# EAGLE design kontrol_v2 (EAGLE 9.6.1)
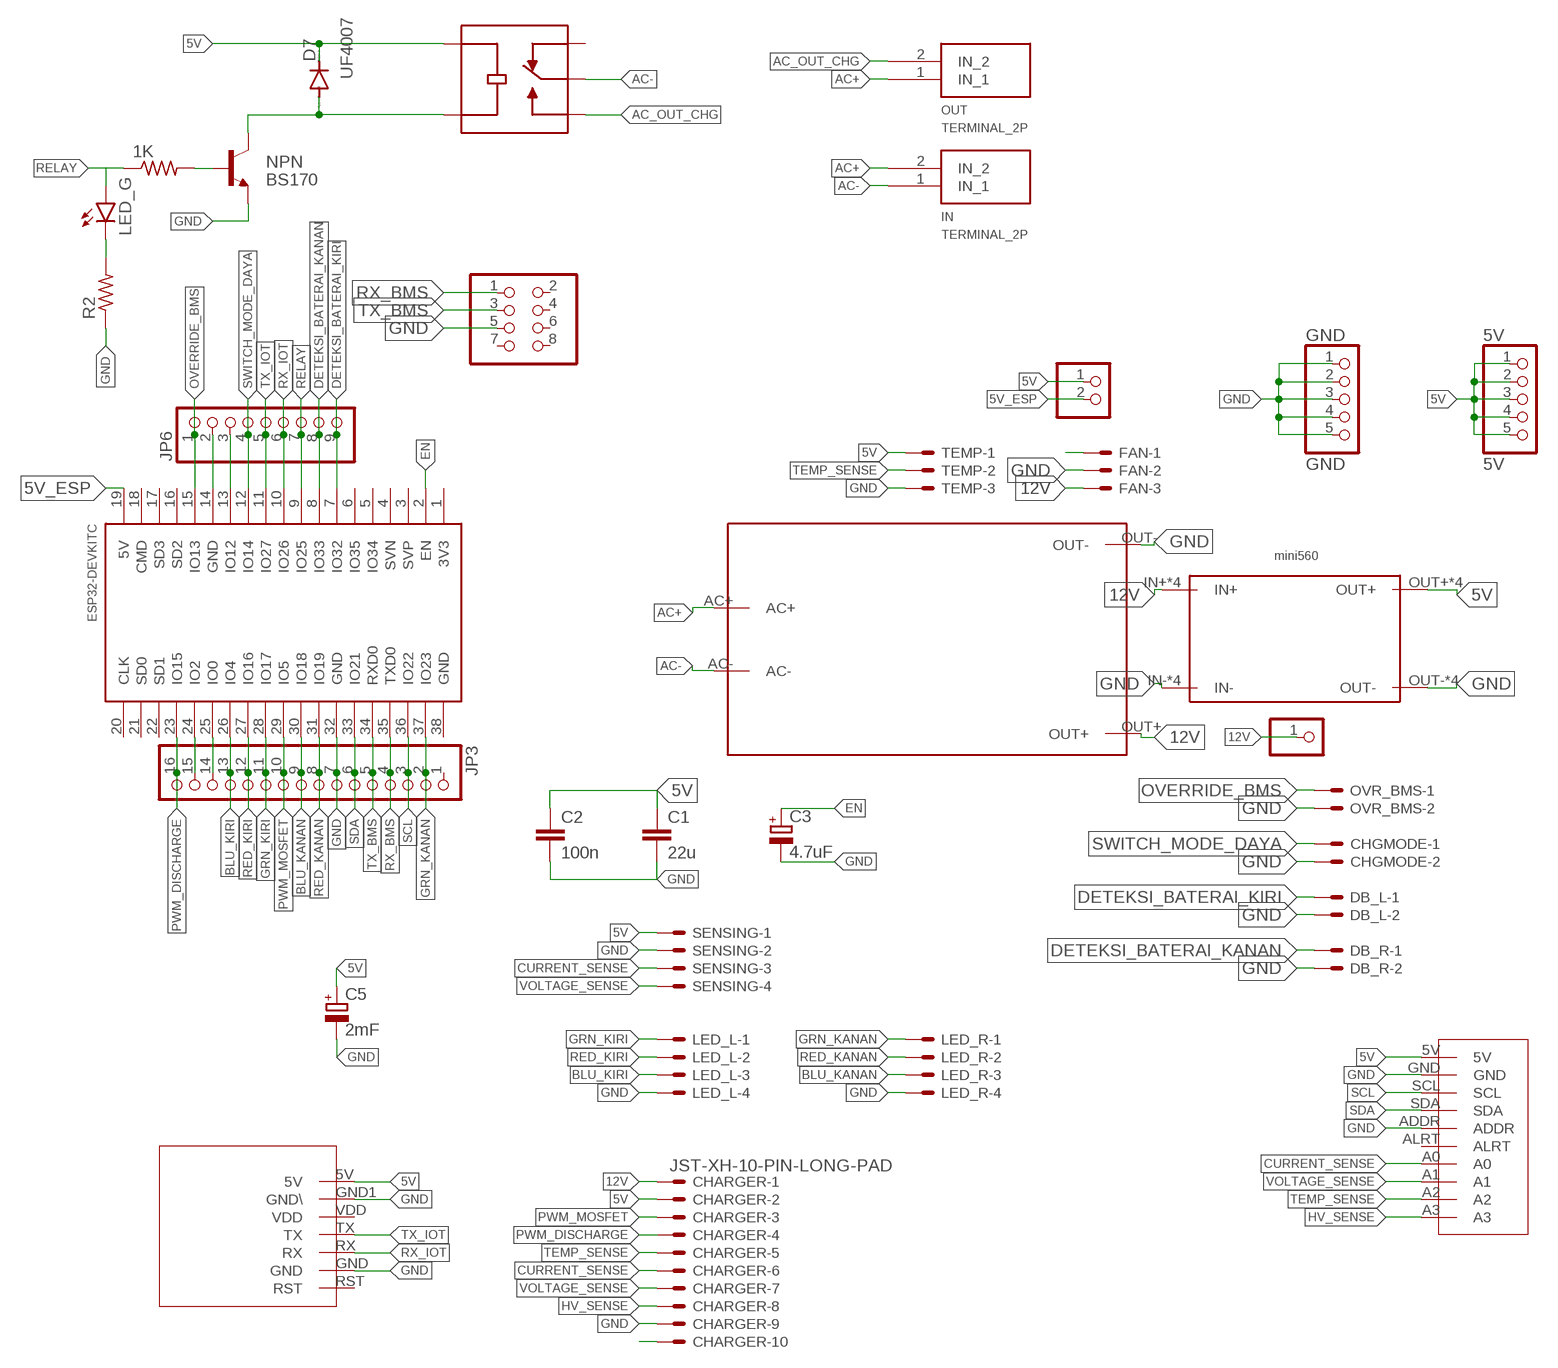
[diagram p0: schematic, sheet 1]

## Parts
1K  1k  R-US_0204/7  [0204/7]
5V  5V  PINHD-1X5  [1X05]
C1  22u  C2.5/5  [C2.5-5]
C2  100n  C2.5/6  [C2.5-6]
C3  4.7uF  CPOL-EUE2,5-6E  [E2,5-6E]
C5  2mF  CPOL-EUE3.5-10  [E3,5-10]
CHARGER  JST-XH-10-PIN-LONG-PAD  [JST-XH-10-PACKAGE-LONG-PAD]
CHGMODE  JST-XH-02-PIN-LONG-PAD  [JST-XH-02-PACKAGE-LONG-PAD]
D4  LED_G  LED5MM  [LED_5MM]
D7  UF4007  BAS15  [DO34-7]
DB_L  JST-XH-02-PIN-LONG-PAD  [JST-XH-02-PACKAGE-LONG-PAD]
DB_R  JST-XH-02-PIN-LONG-PAD  [JST-XH-02-PACKAGE-LONG-PAD]
FAN  JST-XH-03-PIN-LONG-PAD  [JST-XH-03-PACKAGE-LONG-PAD]
GND  GND  PINHD-1X5  [1X05]
HI_LINK1  HI_LINK  [HI_LINK]
IN  TERMINAL_2P  [TERMINAL_2P]
JP2  PINHD-2X4  [2X04]
JP3  PINHD-1X16  [1X16]
JP4  PINHD-1X1  [1X01]
JP6  PINHD-1X9  [1X09]
JP7  PINHD-1X2  [1X02]
K1  SRD-12VDC-SL-C  [RELAY_SRD-12VDC-SL-C]
LED_L  JST-XH-04-PIN-LONG-PAD  [JST-XH-04-PACKAGE-LONG-PAD]
LED_R  JST-XH-04-PIN-LONG-PAD  [JST-XH-04-PACKAGE-LONG-PAD]
MINI1  MINI560  [MINI560]
NPN  BS170  BC547A-NPN-TO92-CBE  [TO92-CBE]
OUT  TERMINAL_2P  [TERMINAL_2P]
OVR_BMS  JST-XH-02-PIN-LONG-PAD  [JST-XH-02-PACKAGE-LONG-PAD]
R2  6k  R-US_0204/7  [0204/7]
SENSING  JST-XH-04-PIN-LONG-PAD  [JST-XH-04-PACKAGE-LONG-PAD]
TEMP  JST-XH-03-PIN-LONG-PAD  [JST-XH-03-PACKAGE-LONG-PAD]
U$1  ESP32DEVKITC  [ESP32-DEVKITC]
U$2  ADS1115  [ADS1115]
U$3  SIM800V2  [SIM800V2]

## Nets
5V: 5V.1 5V.2 5V.3 5V.4 5V.5 C1.1 C2.1 C5.+ CHARGER.2 D7.C JP7.1 K1.COIL1 MINI1.OUT+ MINI1.OUT+1(OUT+) MINI1.OUT+2(OUT+) MINI1.OUT+3(OUT+) SENSING.1 TEMP.1 U$2.5V U$3.5V
5V_ESP: JP7.2 U$1.19(5V)
12V: CHARGER.1 FAN.3 HI_LINK1.OUT+ JP4.1 MINI1.IN+ MINI1.IN+1(IN+) MINI1.IN+2(IN+) MINI1.IN+3(IN+)
AC+: HI_LINK1.AC+ IN.2(IN_2) OUT.1(IN_1)
AC-: HI_LINK1.AC- IN.1(IN_1) K1.COM
AC_OUT_CHG: K1.NO OUT.2(IN_2)
BLU_KANAN: JP3.9 LED_R.3 U$1.30(IO18)
BLU_KIRI: JP3.13 LED_L.3 U$1.26(IO4)
CURRENT_SENSE: CHARGER.6 SENSING.3 U$2.A0
DETEKSI_BATERAI_KANAN: DB_R.1 JP6.8 U$1.8(IO33)
DETEKSI_BATERAI_KIRI: DB_L.1 JP6.9 U$1.7(IO32)
EN: C3.+ U$1.2(EN)
GND: C1.2 C2.2 C3.- C5.- CHARGER.9 CHGMODE.2 DB_L.2 DB_R.2 FAN.2 GND.1 GND.2 GND.3 GND.4 GND.5 HI_LINK1.OUT- JP2.5 JP3.7 LED_L.4 LED_R.4 MINI1.IN- MINI1.IN-1(IN-) MINI1.IN-2(IN-) MINI1.IN-3(IN-) MINI1.OUT- MINI1.OUT-1(OUT-) MINI1.OUT-2(OUT-) MINI1.OUT-3(OUT-) NPN.E OVR_BMS.2 R2.1 SENSING.2 TEMP.3 U$1.32(GND) U$2.ADDR U$2.GND U$3.GND U$3.GND1(GND\)
GRN_KANAN: JP3.2 LED_R.1 U$1.37(IO23)
GRN_KIRI: JP3.11 LED_L.1 U$1.28(IO17)
HV_SENSE: CHARGER.8 U$2.A3
N$1: D4.K(C) R2.2
N$2: FAN.1
N$8: JP6.2 U$1.14(GND)
N$9: JP6.3 U$1.13(IO12)
N$14: CHARGER.10
N$19: 1K.2 NPN.B
N$21: D7.A K1.COIL2 NPN.C
N$23: JP3.14 U$1.25(IO0)
N$24: JP3.15 U$1.24(IO2)
OVERRIDE_BMS: JP6.1 OVR_BMS.1 U$1.15(IO13)
PWM_DISCHARGE: CHARGER.4 JP3.16 U$1.23(IO15)
PWM_MOSFET: CHARGER.3 JP3.10 U$1.29(IO5)
RED_KANAN: JP3.8 LED_R.2 U$1.31(IO19)
RED_KIRI: JP3.12 LED_L.2 U$1.27(IO16)
RELAY: 1K.1 D4.A JP6.7 U$1.9(IO25)
RX_BMS: JP2.1 JP3.4 U$1.35(TXD0)
RX_IOT: JP6.6 U$1.10(IO26) U$3.RX
SCL: JP3.3 U$1.36(IO22) U$2.SCL
SDA: JP3.6 U$1.33(IO21) U$2.SDA
SWITCH_MODE_DAYA: CHGMODE.1 JP6.4 U$1.12(IO14)
TEMP_SENSE: CHARGER.5 TEMP.2 U$2.A2
TX_BMS: JP2.3 JP3.5 U$1.34(RXD0)
TX_IOT: JP6.5 U$1.11(IO27) U$3.TX
VOLTAGE_SENSE: CHARGER.7 SENSING.4 U$2.A1
Unconnected: JP2.2 JP2.4 JP2.6 JP2.7 JP2.8 JP3.1 K1.NC U$1.1(3V3) U$1.3(SVP) U$1.4(SVN) U$1.5(IO34) U$1.6(IO35) U$1.16(SD2) U$1.17(SD3) U$1.18(CMD) U$1.20(CLK) U$1.21(SD0) U$1.22(SD1) U$1.38(GND) U$2.ALRT U$3.RST U$3.VDD

## Library data of the parts
1K R2 = rcl:R-US_: RESISTOR, American symbol; SPICEPREFIX: R
5V GND = pinhead:PINHD-1X5: PIN HEADER
C1 C2 = capacitor-wima:C: CAPACITOR naming: grid - package width
C3 C5 = rcl:CPOL-EU: POLARIZED CAPACITOR, European symbol; SPICEPREFIX: C
CHARGER = Rembrandt Electronics - JST XH Connectors v1-0:JST-XH-10-PIN: JST XH Connector 2 Pin Wire to board connector. Pitch: 2,54 mm, (0.100") Number of pins: 10 Created by Rembrandt Electronics www.rembrandtelectronics.com
CHGMODE DB_L DB_R OVR_BMS = JST XH Connectors v1-0:JST-XH-02-PIN: JST XH Connector 2 Pin Wire to board connector. Pitch: 2,54 mm, (0.100") Number of pins: 2 Created by Rembrandt Electronics www.rembrandtelectronics.com
D4 = Sparkfun_LED:LED: LED (Generic) Standard schematic elements and footprints for 5mm, 3mm, 1206, and 0603 sized LEDs. Generic LEDs with no color specified.
D7 = diode:BAS15: DIODE high speed
FAN TEMP = JST XH Connectors v1-0:JST-XH-03-PIN: JST XH Connector 2 Pin Wire to board connector. Pitch: 2,54 mm, (0.100") Number of pins: 3 Created by Rembrandt Electronics www.rembrandtelectronics.com
HI_LINK1 = Hi Link:HI_LINK
IN OUT = TA_library:TERMINAL_2P
JP2 = pinhead:PINHD-2X4: PIN HEADER
JP3 = pinhead:PINHD-1X16: PIN HEADER
JP4 = pinhead:PINHD-1X1: PIN HEADER
JP6 = pinhead:PINHD-1X9: PIN HEADER
JP7 = pinhead:PINHD-1X2: PIN HEADER
K1 = TA_library:SRD-12VDC-SL-C: General Purpose Non Latching 12VDC SPDT Through Hole Relays RoHS Check availability <https://pricing.snapeda.com/parts/SRD-12VDC-SL-C/Songle%20Relay/view-part?ref=eda>; AVAILABILITY: Not in stock; DESCRIPTION: General Purpose Non Latching 12VDC SPDT Through Hole Relays RoHS; MF: Songle Relay; MP: SRD-12VDC-SL-C; PACKAGE: Package; PRICE: None
LED_L LED_R SENSING = JST XH Connectors v1-0:JST-XH-04-PIN: JST XH Connector 2 Pin Wire to board connector. Pitch: 2,54 mm, (0.100") Number of pins: 4 Created by Rembrandt Electronics www.rembrandtelectronics.com
MINI1 = mini560:MINI560
NPN = transistor:*-NPN-: NPN Transistror BF959 corrected 2008.03.06
U$1 = ESP32-DEVKITC:ESP32DEVKITC
U$2 = ADS1115:ADS1115
U$3 = sim800v2:SIM800V2

## Net classes
1 3A: width 3.302 mm, clearance 0.61 mm
3 HIGH Voltage: width 2.032 mm, clearance 2.54 mm
4 AC: width 2.032 mm, clearance 2.54 mm

## Board
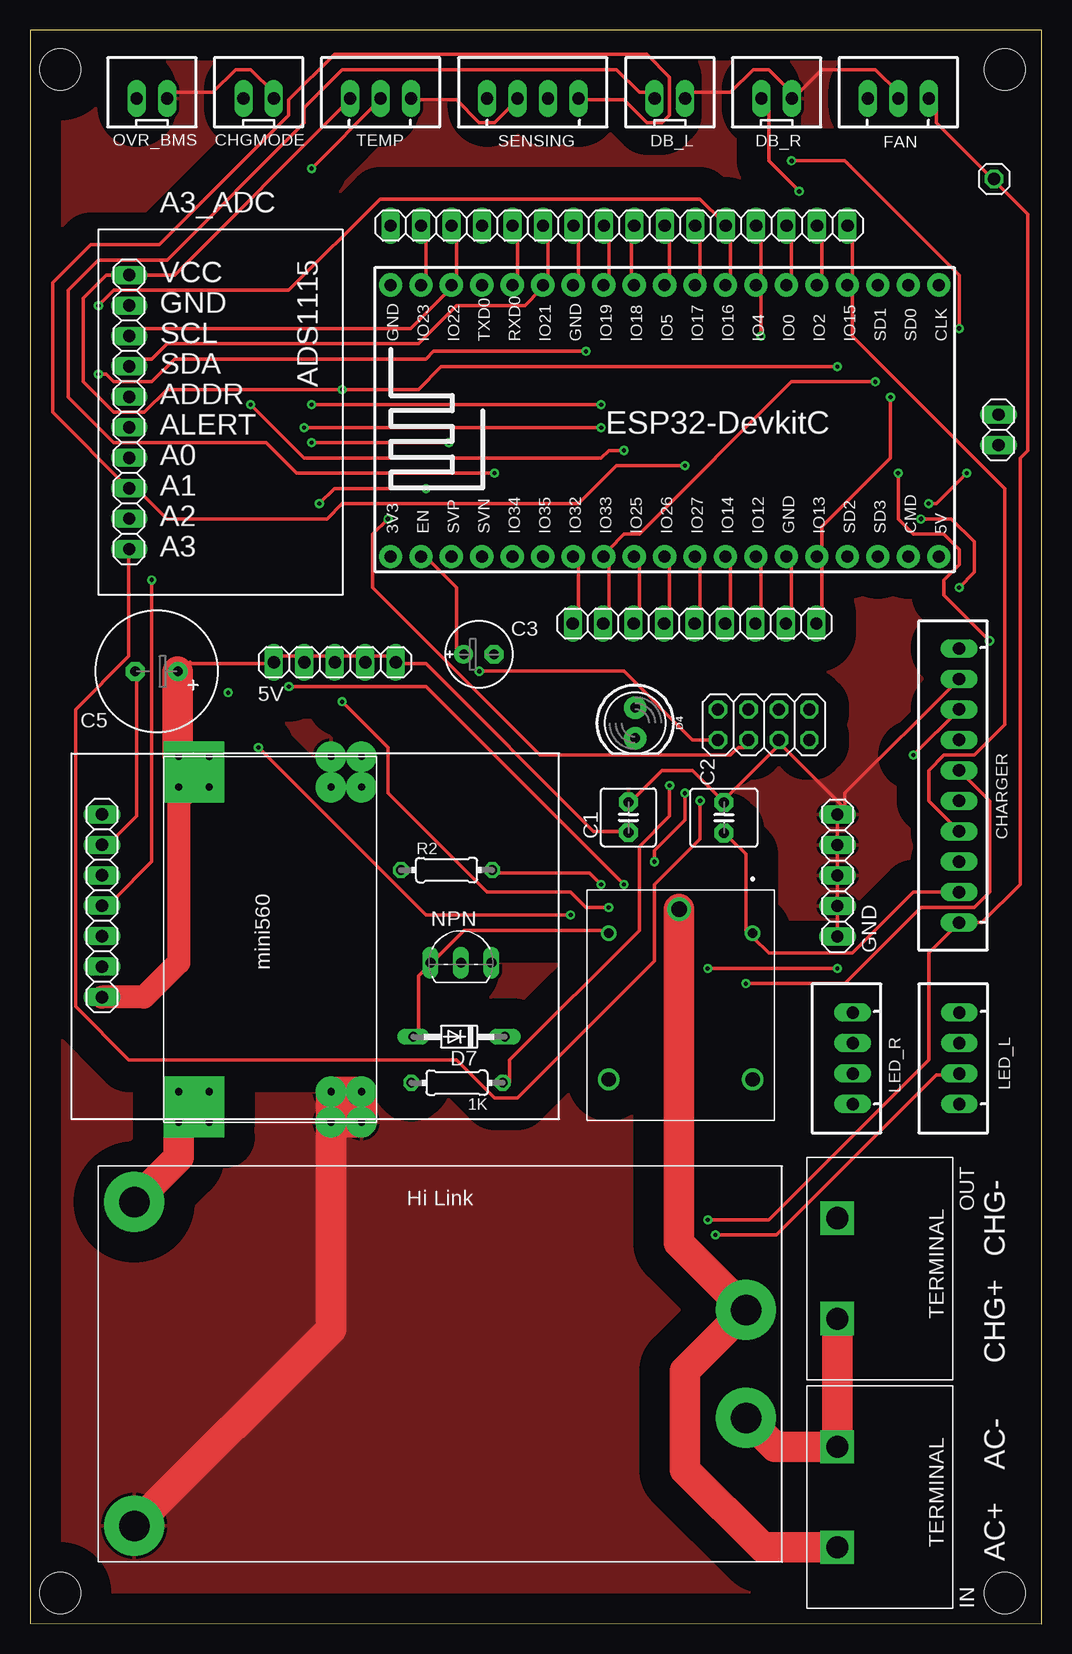
[diagram p1: board, top side]
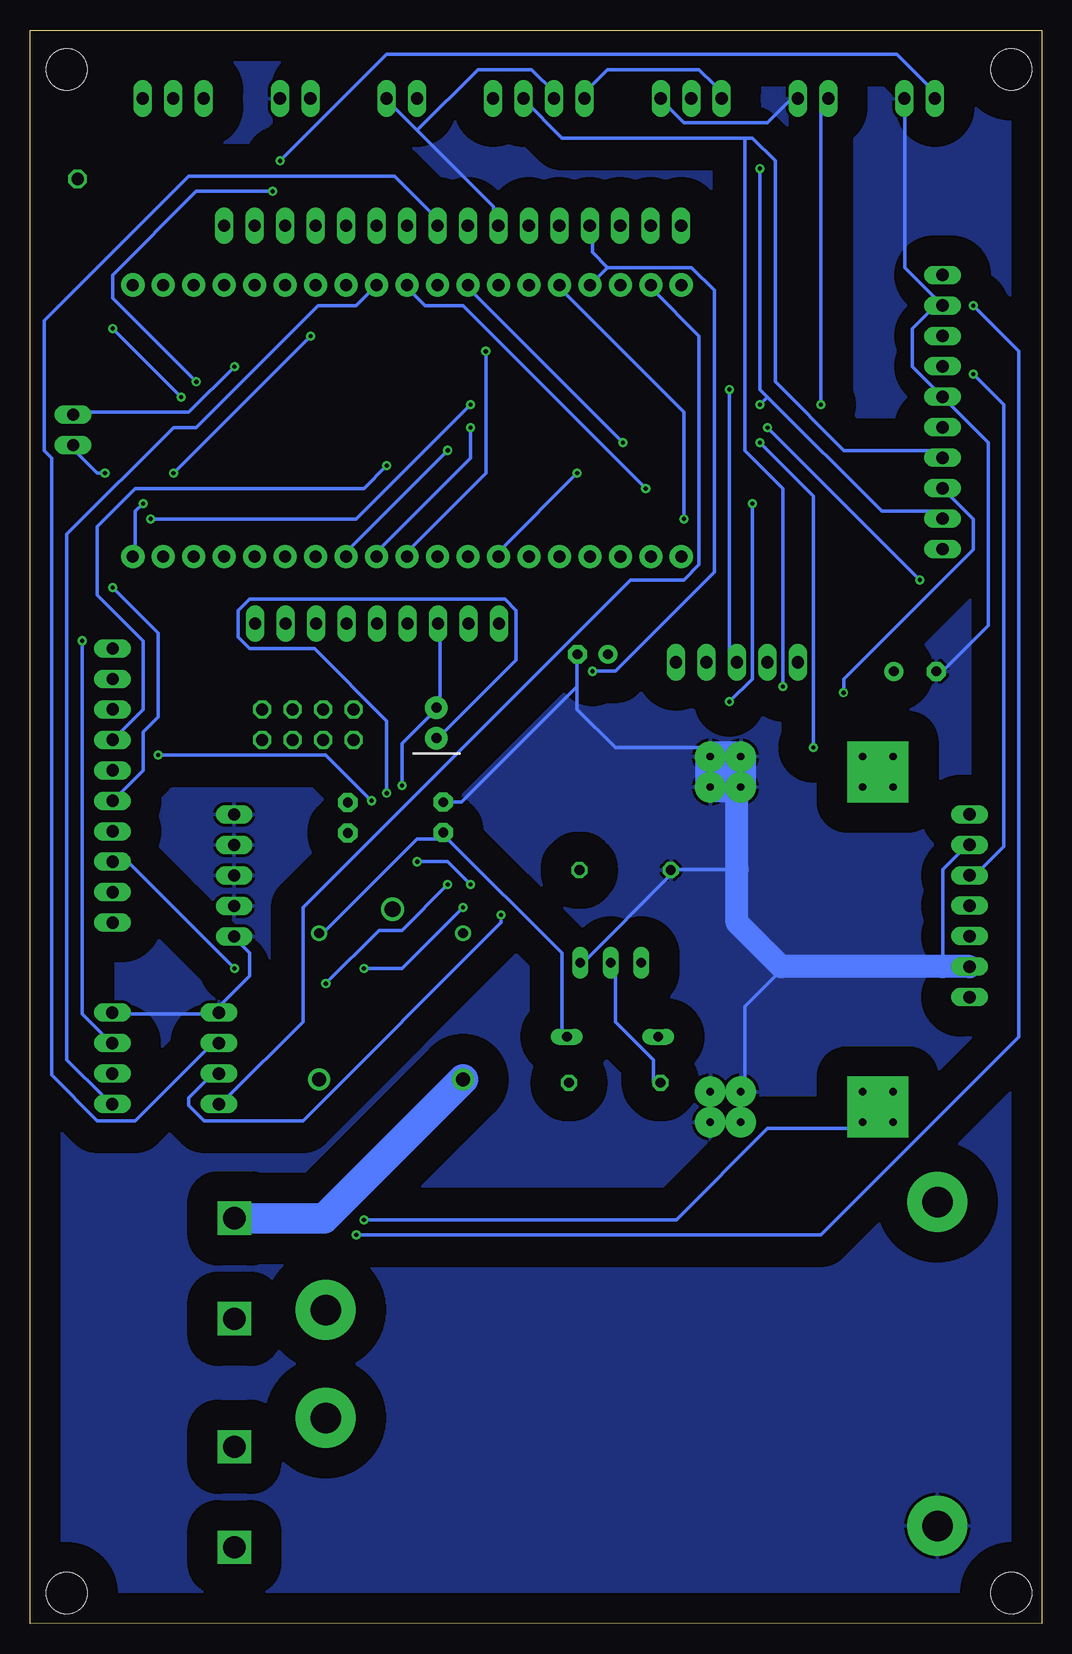
[diagram p2: board, bottom side, seen from below]

Size 84.35 x 132.84 mm. Coordinates in mm from the lower left corner, seen from the top.
Outline: 0,0.01 84.34,0 84.35,132.81 0.01,132.84 0,0.01
Copper layers (1*16): Top 0.035mm / dielectric 1.5mm / Bottom 0.035mm
Design rules "default *": minimum track width 12mil, minimum drill 0.35mm, track to track 24mil, track to pad 12mil, pad to pad 12mil, via to via 24mil, smd to smd 12mil, copper to edge 40mil, drill to drill 6mil, minimum pad ring 10mil, minimum via ring 8mil, stop-mask expansion 4mil, vias tented up to drill 0mil, thermal gap 10mil
Holes 3.4 mm at 81.27,2.55 2.53,129.55 81.27,129.55 2.53,2.55

### Footprints (pad centres in the part's own frame; a part is rotated, then mirrored left to right if it is on the bottom)
0204/7 = drill 0.813 octagon: 1 -3.81,0; 2 3.81,0
1X05 = drill 1.016 long: 1 -5.08,0; 2 -2.54,0; 3 0,0; 4 2.54,0; 5 5.08,0
C2.5-5 = drill 0.813 pad 1.6 octagon: 1 -1.27,0; 2 1.27,0
C2.5-6 = drill 0.813 pad 1.6 octagon: 1 -1.27,0; 2 1.27,0
E2,5-6E = drill 0.813 pad 1.575: + -1.27,0 | drill 0.813 pad 1.575 octagon: - 1.27,0
E3,5-10 = drill 0.813 pad 1.6: + -1.778,0 | drill 0.813 pad 1.6 octagon: - 1.778,0
JST-XH-10-PACKAGE-LONG-PAD = drill 1.016 long: 1 -11.43,0; 2 -8.89,0; 3 -6.35,0; 4 -3.81,0; 5 -1.27,0; 6 1.27,0; 7 3.81,0; 8 6.35,0; 9 8.89,0; 10 11.43,0
JST-XH-02-PACKAGE-LONG-PAD = drill 1.016 long: 1 -1.27,0; 2 1.27,0
LED_5MM = drill 0.813 pad 1.88: A -1.27,0; K 1.27,0
DO34-7 = drill 0.813 long: A 3.81,0; C -3.81,0
JST-XH-03-PACKAGE-LONG-PAD = drill 1.016 long: 1 -2.54,0; 2 0,0; 3 2.54,0
HI_LINK = drill 2.54 pad 5: AC+ -23.67,4.49; AC- -23.67,-4.51; OUT+ 27.33,-13.51; OUT- 27.33,13.49
TERMINAL_2P = drill 1.854 square: 1 0,-3.81; 2 0,4.572
2X04 = drill 1.016 octagon: 1 -3.81,-1.27; 2 -3.81,1.27; 3 -1.27,-1.27; 4 -1.27,1.27; 5 1.27,-1.27; 6 1.27,1.27; 7 3.81,-1.27; 8 3.81,1.27
1X16 = drill 1.016 long: 1 -19.05,0; 2 -16.51,0; 3 -13.97,0; 4 -11.43,0; 5 -8.89,0; 6 -6.35,0; 7 -3.81,0; 8 -1.27,0; 9 1.27,0; 10 3.81,0; 11 6.35,0; 12 8.89,0; 13 11.43,0; 14 13.97,0; 15 16.51,0; 16 19.05,0
1X01 = drill 1.016 octagon: 1 0,0
1X09 = drill 1.016 long: 1 -10.16,0; 2 -7.62,0; 3 -5.08,0; 4 -2.54,0; 5 0,0; 6 2.54,0; 7 5.08,0; 8 7.62,0; 9 10.16,0
1X02 = drill 1.016 long: 1 -1.27,0; 2 1.27,0
RELAY_SRD-12VDC-SL-C = drill 0.8: COIL1 -6.1,6; COIL2 -6.1,-6 | drill 1.3: COM -8.1,-0.12 | drill 1.2: NC 6.1,6; NO 6.1,-6
JST-XH-04-PACKAGE-LONG-PAD = drill 1.016 long: 1 -3.81,0; 2 -1.27,0; 3 1.27,0; 4 3.81,0
MINI560 = drill 0.6 pad 2.54 square: IN+ 2.54,16.51; IN+1 2.54,13.97; IN+2 0,13.97; IN+3 0,16.51; OUT+ 27.94,16.51; OUT+1 27.94,13.97; OUT+2 30.48,16.51; OUT+3 30.48,13.97 | drill 0.6 pad 2.54: IN- 2.54,1.27; IN-1 0,3.81; IN-2 2.54,3.81; IN-3 0,1.27; OUT- 27.94,1.27; OUT-1 27.94,3.81; OUT-2 30.48,3.81; OUT-3 30.48,1.27
TO92-CBE = drill 0.813 long: B 0,0; C -2.54,0; E 2.54,0
ESP32-DEVKITC = drill 1 pad 1.93: 1 -22.87,-11.42; 2 -20.33,-11.42; 3 -17.79,-11.42; 4 -15.25,-11.42; 5 -12.71,-11.42; 6 -10.17,-11.42; 7 -7.63,-11.42; 8 -5.09,-11.42; 9 -2.55,-11.42; 10 -0.01,-11.42; 11 2.53,-11.42; 12 5.07,-11.42; 13 7.61,-11.42; 14 10.15,-11.42; 15 12.69,-11.42; 16 15.23,-11.42; 17 17.77,-11.42; 18 20.31,-11.42; 19 22.85,-11.42; 20 22.85,11.23; 21 20.31,11.23; 22 17.77,11.23; 23 15.23,11.23; 24 12.69,11.23; 25 10.15,11.23; 26 7.61,11.23; 27 5.07,11.23; 28 2.53,11.23; 29 -0.01,11.23; 30 -2.55,11.23; 31 -5.09,11.23; 32 -7.63,11.23; 33 -10.17,11.23; 34 -12.71,11.23; 35 -15.25,11.23; 36 -17.79,11.23; 37 -20.33,11.23; 38 -22.87,11.23
ADS1115 = drill 1.016 long: 5V -11.43,-7.62; A0 3.81,-7.62; A1 6.35,-7.62; A2 8.89,-7.62; A3 11.43,-7.62; ADDR -1.27,-7.62; ALRT 1.27,-7.62; GND -8.89,-7.62; SCL -6.35,-7.62; SDA -3.81,-7.62
SIM800V2 = drill 1.016 long: 5V 7.62,0; GND 5.08,0; GND1 -5.08,0; RST -7.62,0; RX -2.54,0; TX 0,0; VDD 2.54,0

### Placement (x,y rotation side)
1K  35.6,45.09 180 top
5V  25.41,80.14 0 top
C1  49.9,67.21 90 top
C2  57.86,67.18 90 top
C3  37.43,80.8 0 top
C5  10.55,79.38 180 top
CHARGER  77.46,69.86 90 top
CHGMODE  19.06,127.13 0 top
D4  50.46,75.08 270 top
D7  35.78,48.92 180 top
DB_L  53.35,127.13 0 top
DB_R  62.24,127.13 0 top
FAN  72.4,127.13 0 top
GND  67.32,62.36 90 top
HI_LINK1  36.03,21.64 180 top
IN  67.3,10.17 0 top
JP2  61.18,74.93 0 top
JP3  49.11,116.54 0 top
JP4  80.38,120.42 0 top
JP6  55.41,83.36 180 top
JP7  80.75,99.51 270 top
K1  54.24,51.46 270 top
LED_L  77.48,47.12 90 top
LED_R  68.59,47.12 90 top
MINI1  28.91,41.79 90 top
NPN  35.93,55.09 0 top
OUT  67.3,29.22 0 top
OVR_BMS  10.17,127.13 0 top
R2  34.73,62.81 0 top
SENSING  41.92,127.13 0 top
TEMP  29.22,127.13 0 top
U$1  52.92,100.36 0 top
U$2  15.89,100.99 270 top
U$3  6.01,59.84 270 top

### Tracks (layer width: path | path; a pad name or v marks a point on that pad's centre or on a via)
5V  (via drill 0.35)
  Top 0.305: 12.08,80.14 C5.+ | 13.35,80.14 C5.+ | C2.1 58.41,65.42 59.68,64.15 59.68,57.8 K1.COIL1 60.32,57.16 61.59,55.89 68.57,55.89 73.65,60.97 CHARGER.2 | C5.+ 13.33,80.02 20.31,80.02 5V.1 20.95,80.66 22.85,80.66 5V.2 23.49,80.66 25.39,80.66 5V.3 26.03,80.66 27.93,80.66 5V.4 28.57,80.66 30.47,80.66 5V.5 31.11,80.02 33.01,80.02 46.98,66.05 49.52,66.05 C1.1 | v67.3,104.79 34.28,104.79 32.38,102.88 v26.03,102.88 11.42,102.88 9.52,100.98 6.98,100.98 4.44,103.52 4.44,110.5 6.34,112.41 8.25,112.41 U$2.5V 8.88,112.41 12.06,112.41 26.66,127.01 TEMP.1
  Top 1.905: MINI1.OUT+ 12.4,55.11 9.51,52.22 U$3.5V
  Top 2.54: MINI1.OUT+2 MINI1.OUT+3 MINI1.OUT+1 MINI1.OUT+ | MINI1.OUT+2 MINI1.OUT+ | MINI1.OUT+ 12.71,69.42 | C5.+ 12.33,72.34 MINI1.OUT+2
  Bottom 0.305: D7.C 40,49.54 40,55.89 49.52,65.42 C1.1 50.16,65.42 52.06,65.42 59.68,57.8 K1.COIL1 | TEMP.1 27.3,127.65 27.3,128.28 28.57,129.55 36.19,129.55 38.09,127.65 SENSING.1 | v67.3,104.79 71.11,100.98 80.64,100.98 JP7.1 | v26.03,102.88 26.03,80.66 5V.3
5V_ESP  (via drill 0.35)
  Top 0.305: v78.1,95.9 75.56,93.36 v74.92,93.36
  Bottom 0.305: v78.1,95.9 78.73,95.9 80.64,97.8 JP7.2 | v74.92,93.36 75.56,92.72 75.56,89.55 U$1.19
12V  (via drill 0.35)
  Top 0.305: 11.44,44.58 MINI1.IN+ | 15.25,45.21 MINI1.IN+1 | FAN.3 75.56,127.01 75.56,125.11 80,120.66 JP4.1 80.64,120.03 83.18,117.49 83.18,97.8 82.54,97.17 82.54,61.61 79.37,58.43 CHARGER.1 74.92,55.89 74.92,47 61.59,33.67 v56.51,33.67
  Top 2.54: HI_LINK1.OUT+ 12.4,38.85 MINI1.IN+3 | MINI1.IN+3 MINI1.IN+ MINI1.IN+1 MINI1.IN+2 MINI1.IN+3
  Bottom 0.305: v56.51,33.67 30.47,33.67 22.85,41.29 15.23,41.29 MINI1.IN+2
AC+
  Top 2.54: 60.72,16.13 HI_LINK1.AC+ 62.11,14.74 IN.2 OUT.1
AC-
  Top 2.54: K1.COM 54.12,31.73 HI_LINK1.AC- 54.62,21.07 54.62,12.83 61.09,6.36 IN.1
AC_OUT_CHG
  Bottom 2.54: K1.NO 59.81,33.79 OUT.2
BLU_KANAN
  Top 0.305: U$1.30 50.16,111.77 50.16,116.22 JP3.9
  Bottom 0.305: LED_R.3 69.21,48.27 75.56,41.92 78.73,41.92 82.54,45.73 82.54,97.17 83.18,97.8 83.18,108.6 71.11,120.66 53.97,120.66 50.16,116.85 JP3.9
BLU_KIRI  (via drill 0.35)
  Top 0.305: v80,81.93 76.19,85.74 76.19,87.01 77.46,88.28 77.46,89.55 76.19,90.82 73.65,90.82 72.38,92.09 v72.38,95.9 | v60.95,107.33 60.95,111.14 U$1.26 60.95,111.77 60.95,116.22 JP3.13
  Bottom 0.305: v80,81.93 80,50.81 78.1,48.91 LED_L.3 | v60.95,107.33 v72.38,95.9
CURRENT_SENSE  (via drill 0.35)
  Top 0.305: CHARGER.6 80,68.59 80,60.97 78.73,59.7 74.29,59.7 67.94,53.35 v59.68,53.35 | v49.52,61.61 33.01,78.12 v21.58,78.12
  Bottom 0.305: 24.76,123.84 40,123.84 43.17,127.01 SENSING.3 | 24.76,123.84 24.12,123.84 22.22,121.93 22.22,103.52 16.5,97.8 8.88,97.8 U$2.A0 | v59.68,53.35 55.24,57.8 53.33,57.8 v49.52,61.61 | v21.58,78.12 21.58,94.63 24.76,97.8 24.76,123.84
DETEKSI_BATERAI_KANAN  (via drill 0.35)
  Top 0.305: JP6.8 48.25,83.83 48.25,88.91 U$1.8 48.25,89.55 49.52,90.82 50.79,90.82 63.49,103.52 v70.48,103.52 | v64.13,119.39 61.59,121.93 61.59,127.01 DB_R.1
  Bottom 0.305: v64.13,119.39 70.48,119.39 77.46,112.41 77.46,110.5 v70.48,103.52
DETEKSI_BATERAI_KIRI  (via drill 0.35)
  Top 0.305: JP6.9 45.71,83.83 45.71,88.91 U$1.7 | v38.73,95.9 22.22,95.9 19.68,98.44 6.98,98.44 3.17,102.25 3.17,111.14 5.71,113.68 11.42,113.68 22.85,125.11 22.85,126.38 26.03,129.55 48.89,129.55 50.79,127.65 52.06,127.65 DB_L.1
  Bottom 0.305: v38.73,95.9 45.08,89.55 U$1.7
EN
  Top 0.305: C3.+ 35.55,81.29 35.55,86.37 33.01,88.91 U$1.2
GND
  Top 0.305: 27.95,45.21 MINI1.IN- | JP3.7 45.71,116.22 45.71,111.77 U$1.32 | DB_L.2 55.24,127.65 58.41,127.65 60.32,129.55 61.59,129.55 63.49,127.65 DB_R.2 64.13,127.65 66.03,129.55 70.48,129.55 72.38,127.65 FAN.2 | TEMP.3 32.38,127.01 35.55,127.01 37.46,125.11 38.73,125.11 40.63,127.01 SENSING.2 | OVR_BMS.2 12.06,127.65 15.23,127.65 17.14,129.55 18.41,129.55 20.31,127.65 CHGMODE.2 | 57.78,68.59 62.22,73.04 JP2.5 62.86,73.04 67.94,67.96 | 57.78,68.59 55.24,71.13 52.7,71.13 50.16,68.59 C1.2 | 57.78,68.59 C2.2 | GND.1 67.3,57.8 67.3,59.7 GND.2 67.3,60.34 67.3,62.24 GND.3 67.3,62.88 67.3,64.78 GND.4 67.3,65.42 67.3,67.32 GND.5 67.94,67.96 | CHARGER.9 67.94,69.23 67.94,67.96 | C5.- 8.88,78.75 8.88,67.32 6.34,64.78 U$3.GND1
  Top 2.54: HI_LINK1.OUT- 25.1,24.55 MINI1.IN-1 | MINI1.IN-1 MINI1.IN-2 MINI1.IN- MINI1.IN-3 MINI1.IN-1
  Bottom 0.305: 28.59,72.52 MINI1.OUT-3 28.57,73.04 35.55,73.04 38.73,76.21 38.73,78.12 | 52.06,124.47 54.6,127.01 DB_L.2 | 52.06,124.47 45.71,118.12 45.71,116.85 JP3.7 | OVR_BMS.2 11.42,127.01 11.42,113.04 8.88,110.5 U$2.GND 8.88,109.87 10.79,107.96 10.79,104.79 8.88,102.88 U$2.ADDR 8.25,102.25 4.44,98.44 4.44,83.2 8.25,79.39 C5.- | TEMP.3 31.74,127.01 29.84,125.11 22.85,125.11 20.95,127.01 CHGMODE.2 | 52.06,124.47 46.98,129.55 42.54,129.55 40.63,127.65 SENSING.2 | LED_L.4 77.46,50.81 69.21,50.81 LED_R.4 68.57,51.45 66.03,53.99 66.03,55.89 67.3,57.16 GND.1 | NPN.E 38.09,55.26 31.11,62.24 R2.1 30.47,62.88 25.39,62.88 | 8.25,54.76 8.25,62.88 6.34,64.78 U$3.GND1 | 38.73,78.12 38.73,80.66 C3.- | 38.73,78.12 48.37,68.48 C1.2 | MINI1.IN-2 24.76,44.46 24.76,51.45 22.22,53.99 21.72,54.76
  Bottom 1.905: U$3.GND 8.25,54.76 21.72,54.76 25.39,58.43 25.39,62.88 25.39,69.44 MINI1.OUT-1
  Bottom 2.54: MINI1.OUT- MINI1.OUT-1 MINI1.OUT-2 MINI1.OUT-3 MINI1.OUT-
  pour Bottom (isolate 2.54): -2.55,135.9 88.89,135.9 88.89,-5.07 -5.09,-5.07 -5.09,133.36
  pour Top (isolate 2.54): -5.09,137.17 87.62,137.17 91.43,133.36 91.43,-6.34 90.16,-7.61 -3.82,-7.61 -6.36,-5.07 -6.36,135.9
GRN_KANAN
  Top 0.305: JP3.2 33.01,116.22 33.01,111.77 U$1.37
  Bottom 0.305: LED_R.1 68.57,43.83 67.94,43.83 61.59,50.18 61.59,59.7 34.28,87.01 29.84,87.01 28.57,88.28 28.57,107.33 32.38,111.14 U$1.37
GRN_KIRI
  Top 0.305: JP3.11 55.87,116.22 55.87,111.77 U$1.28
  Bottom 0.305: LED_L.1 78.1,43.83 81.27,47 81.27,90.82 72.38,99.71 70.48,99.71 60.32,109.87 57.14,109.87 55.87,111.14 U$1.28
HV_SENSE  (via drill 0.35)
  Top 0.305: v55.87,68.59 55.87,65.42 52.06,61.61 52.06,55.26 40.63,43.83 38.73,43.83 35.55,47 8.25,47 3.8,51.45 3.8,76.21 8.25,80.66 8.25,89.55 U$2.A3 | CHARGER.8 v73.65,72.4
  Bottom 0.305: v55.87,68.59 59.68,72.4 v73.65,72.4
N$1  (via drill 0.35)
  Top 0.305: v47.62,61.61 46.66,62.56 38.73,62.56 R2.2 | v52.06,63.51 52.06,64.46 54.6,67 v54.6,69.23
  Bottom 0.305: v47.62,61.61 49.52,63.51 v52.06,63.51 | v54.6,69.23 54.6,75.26 60.63,81.29 66.03,81.29 66.99,82.24 66.99,84.47 66.03,85.42 44.76,85.42 43.81,84.47 43.81,80.34 50.16,73.99 D4.K
N$8
  Top 0.305: JP6.2 63.49,83.83 63.49,88.91 U$1.14
N$9
  Top 0.305: JP6.3 60.95,83.83 60.95,88.91 U$1.13
N$19
  Top 0.305: 32.4,45.21 1K.2
  Bottom 0.305: 1K.2 32.38,45.1 32.38,47 35.55,50.18 35.55,54.62 NPN.B
N$21
  Top 0.305: K1.COIL2 47.62,57.8 36.19,57.8 33.65,55.26 NPN.C 33.01,54.62 32.38,53.99 32.38,49.54 D7.A
N$23
  Top 0.305: JP3.14 63.49,116.22 63.49,111.77 U$1.25
N$24
  Top 0.305: JP3.15 66.03,116.22 66.03,111.77 U$1.24
OVERRIDE_BMS  (via drill 0.35)
  Top 0.305: JP6.1 66.03,83.83 66.03,88.91 U$1.15 66.03,89.55 66.03,91.45 71.75,97.17 v71.75,102.25 | v63.49,121.93 67.94,121.93 77.46,112.41 v77.46,107.96
  Bottom 0.305: v63.49,121.93 54.6,130.82 12.06,130.82 9.52,128.28 9.52,127.65 OVR_BMS.1 | v71.75,102.25 v77.46,107.96
PWM_DISCHARGE
  Top 0.305: CHARGER.4 74.92,68.59 74.92,71.13 76.19,72.4 78.73,72.4 81.27,74.94 81.27,94.63 68.57,107.33 68.57,111.14 U$1.23 68.57,111.77 68.57,116.22 JP3.16
PWM_MOSFET  (via drill 0.35)
  Top 0.305: v56.51,54.62 v67.3,54.62 | v48.25,59.7 46.35,59.7 45.08,60.97 38.09,60.97 29.84,69.23 29.84,73.04 v26.03,76.85 | v24.12,93.36 25.39,94.63 v33.01,94.63 | JP3.10 53.33,116.22 53.33,111.77 U$1.29
  Bottom 0.305: CHARGER.3 76.19,63.51 v67.3,54.62 | v56.51,54.62 53.33,54.62 v48.25,59.7 | v26.03,76.85 24.12,78.75 v24.12,93.36 | v33.01,94.63 48.25,109.87 51.43,109.87 52.7,111.14 U$1.29
RED_KANAN  (via drill 0.35)
  Top 0.305: v45.08,59.07 33.01,59.07 v19.04,73.04 | v34.92,98.44 v23.49,98.44 | JP3.8 48.25,116.22 48.25,111.77 U$1.31
  Bottom 0.305: v45.08,59.07 45.08,58.43 61.59,41.92 69.84,41.92 71.11,43.19 71.11,43.83 69.21,45.73 LED_R.2 | v19.04,73.04 19.04,93.99 v23.49,98.44 | v34.92,98.44 47.62,111.14 U$1.31
RED_KIRI  (via drill 0.35)
  Top 0.305: U$1.27 58.41,111.77 58.41,116.22 JP3.12 57.78,116.85 55.87,118.76 29.2,118.76 21.58,111.14 6.98,111.14 v5.71,109.87 | v57.14,32.4 62.22,32.4 75.56,45.73 77.46,45.73 LED_L.2
  Bottom 0.305: v57.14,32.4 18.41,32.4 1.9,48.91 1.9,106.06 v5.71,109.87
RELAY  (via drill 0.35)
  Top 0.305: JP6.7 50.79,83.83 50.79,88.91 U$1.9 | v53.33,69.86 53.33,67.32 50.79,64.78 50.79,57.8 40,47 40,45.1 1K.1
  Bottom 0.305: JP6.7 50.16,83.2 50.16,76.53 D4.A 50.48,76.21 53.33,73.35 v53.33,69.86
RX_BMS  (via drill 0.35)
  Top 0.305: v37.46,79.39 49.52,79.39 55.24,73.67 57.14,73.67 JP2.1
  Bottom 0.305: v37.46,79.39 35.55,79.39 27.3,87.64 27.3,111.14 29.2,113.04 36.19,113.04 | 36.19,113.04 37.46,111.77 U$1.35 | 36.19,113.04 37.46,114.31 37.46,116.22 JP3.4
RX_IOT  (via drill 0.35)
  Top 0.305: v5.71,104.15 6.34,104.15 6.98,103.52 10.15,103.52 12.06,105.42 33.01,105.42 33.65,106.06 v46.35,106.06 | JP6.6 53.33,83.83 53.33,88.91 U$1.10
  Bottom 0.305: v5.71,104.15 3.17,101.61 3.17,64.78 5.07,62.88 5.71,62.88 U$3.RX | v46.35,106.06 46.35,95.9 52.7,89.55 U$1.10
SCL
  Top 0.305: U$2.SCL 8.88,107.96 31.74,107.96 34.92,111.14 U$1.36 35.55,111.77 35.55,116.22 JP3.3
SDA
  Top 0.305: U$2.SDA 8.88,105.42 10.15,105.42 11.42,106.69 32.38,106.69 35.55,109.87 41.27,109.87 42.54,111.14 U$1.33 43.17,111.77 43.17,116.22 JP3.6
SWITCH_MODE_DAYA  (via drill 0.35)
  Top 0.305: v18.41,101.61 22.85,97.17 47.62,97.17 48.25,97.8 v49.52,97.8 | JP6.4 58.41,83.83 58.41,88.91 U$1.12
  Bottom 0.305: v18.41,101.61 18.41,127.01 CHGMODE.1 | v49.52,97.8 57.78,89.55 U$1.12
TEMP_SENSE  (via drill 0.35)
  Top 0.305: v23.49,121.3 29.2,127.01 TEMP.2 | v77.46,86.37 78.73,87.64 78.73,90.18 76.83,92.09 v74.29,92.09 | v23.49,101.61 v47.62,101.61
  Bottom 0.305: 22.85,102.25 23.49,102.88 v23.49,121.3 | 22.85,102.25 13.33,92.72 8.88,92.72 U$2.A2 | CHARGER.5 74.92,71.13 74.92,74.31 73.65,75.58 73.65,82.56 v77.46,86.37 | v74.29,92.09 57.14,92.09 v47.62,101.61 | 22.85,102.25 v23.49,101.61
TX_BMS  (via drill 0.35)
  Top 0.305: v29.84,92.09 28.57,90.82 28.57,86.37 42.54,72.4 58.41,72.4 59.05,73.04 59.68,73.04 JP2.3 | JP3.5 40.63,116.22 40.63,111.77 U$1.34
  Bottom 0.305: v29.84,92.09 29.84,100.98 40,111.14 U$1.34
TX_IOT  (via drill 0.35)
  Top 0.305: v10.15,87.01 10.15,63.51 6.98,60.34 6.34,60.34 U$3.TX | v47.62,99.71 v22.85,99.71 | JP6.5 55.87,83.83 55.87,88.91 U$1.11
  Bottom 0.305: v22.85,99.71 v10.15,87.01 | v47.62,99.71 47.62,97.17 55.24,89.55 U$1.11
VOLTAGE_SENSE  (via drill 0.35)
  Top 0.305: v54.6,96.53 48.89,96.53 45.71,93.36 26.03,93.36 24.76,92.09 11.42,92.09 8.88,94.63 U$2.A1 8.25,94.63 1.9,100.98 1.9,111.77 5.07,114.95 10.79,114.95 21.58,125.74 21.58,127.01 25.39,130.82 51.43,130.82 53.33,128.92 53.33,125.74 52.7,125.11 51.43,125.11 49.52,127.01 46.35,127.01 SENSING.4
  Bottom 0.305: v16.52,77.6 16.5,77.48 16.5,78.75 5.71,89.55 5.71,92.09 8.25,94.63 U$2.A1 | CHARGER.7 74.92,76.21 74.92,81.93 78.73,85.74 78.73,91.45 75.56,94.63 56.51,94.63 v54.6,96.53

### Text on the board
tNames: A3_ADC | CHG- | CHG+ | AC- | AC+